# Altium schematic sheet DAC.SchDoc
size 431 x 279 mm; PartNumber: PNXXXXXXX; Organization: ORGANIZATION; Address1: 207; Address2: 13399 104 Ave; Address3: Surrey BC, V3T 0C9; Address4: Canada; Revision: V0.0.0; SheetNumber: 2; SheetTotal: 4; ENG_APP_DATE: --/--/--; DSN_APP_DATE: --/--/--; CHK_APP_DATE: --/--/--
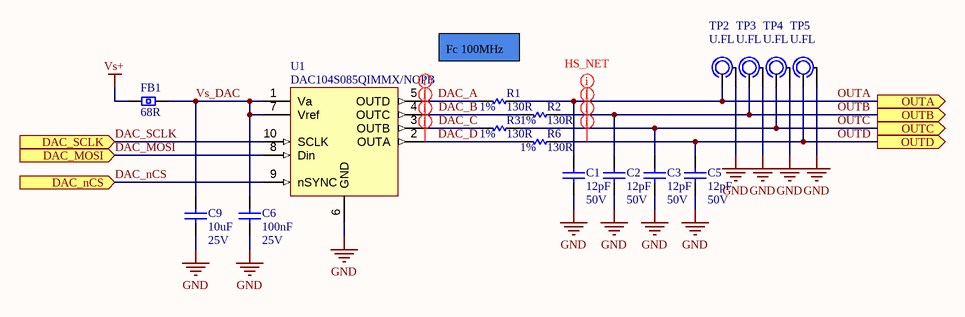
[diagram p0: DAC.SchDoc]

## Parts
C1  12pF  Voltage: 50V  [C0402]
C2  12pF  Voltage: 50V  [C0402]
C3  12pF  Voltage: 50V  [C0402]
C5  12pF  Voltage: 50V  [C0402]
C6  100nF  Voltage Rating: 25V  [C0402]
C9  10uF  Voltage Rating: 25V  [c0805]
FB1  68R  [FB0402]
R1  130R  Tolerance: 1%  [R0402]
R2  130R  Tolerance: 1%  [R0402]
R3  130R  Tolerance: 1%  [R0402]
R6  130R  Tolerance: 1%  [R0402]
TP2  U.FL  [U.FL]
TP3  U.FL  [U.FL]
TP4  U.FL  [U.FL]
TP5  U.FL  [U.FL]
U1  DAC104S085QIMMX/NOPB  [TSSOP50P490X110-10N]

## Ports
DAC_MOSI (in), DAC_nCS (in), DAC_SCLK (in), OUTA (out), OUTB (out), OUTC (out), OUTD (out)

## Nets
GND: C1.1 C2.1 C3.1 C5.1 C6.2 C9.1 TP2.0 TP3.0 TP4.0 TP5.0 U1.6(GND)
Vs+: FB1.2
DAC_A: R1.2 U1.5(OUTD)
DAC_B: R2.2 U1.4(OUTC)
DAC_C: R3.2 U1.3(OUTB)
DAC_D: R6.2 U1.2(OUTA)
DAC_MOSI: U1.8(Din) ; port DAC_MOSI
DAC_nCS: U1.9(nSYNC) ; port DAC_nCS
DAC_SCLK: U1.10(SCLK) ; port DAC_SCLK
OUTA: C1.2 R1.1 TP2.1 ; port OUTA
OUTB: C2.2 R2.1 TP3.1 ; port OUTB
OUTC: C3.2 R3.1 TP4.1 ; port OUTC
OUTD: C5.2 R6.1 TP5.1 ; port OUTD
Vs_DAC: C6.1 C9.2 FB1.1 U1.1(Va) U1.7(Vref)

## Layout directives
net class HS_NET; rule Clearance Constraint [Generic clearance = 10mil, and 30 value(s) for objects]; rule Impedance Constraint [Min = 42.50    Max = 57.50    ]: DAC_A, DAC_B, DAC_C, DAC_D, OUTA, OUTB, OUTC, OUTD

## Notes on the sheet
- Fc 100MHz
- REV:
- PROJECT:
- DATE:
- TITLE
- SHEET
- OF
- DESIGNED:
- REVIEWED:

## Library data of the parts
C1-C3 C5 = CAP CER 12pF 50V C0G 0402: Ceramic capacitor SMD-0402 12pF /50V C0G# J +-5%, Samsung, RoHS; Manufacturer Part Number: CL05C120JB5NNNC; Tolerance: 5%; Dielectric: C0G; Temperature Coefficient: 300ppm/°C; Supplier 1: Digi-Key; Manufacturer: Samsung; RoHS: Yes; Category: Ceramic Capacitors; Stock 1: 41998; Pricing 1: 10000=0.00386, 20000=0.00367 (USD); Mount: Surface Mount; Case/Package: 0402; Case Code (Metric): 1005; Case Code (Imperial): 0402; Material: Ceramic; Contact Plating: Tin; Min Operating Temperature: -55°C; Max Operating Temperature: 125°C; Capacitance: 12pF; Package Quantity: 1; Packaging: Tape and Reel; Voltage Rating: 50V; Series: CL; Construction: Flat; Voltage Rating (DC): 50V; Length: 1mm; Width: 0.02inch; Height: 0.5mm; Thickness: 0.022inch; Depth: 0.5mm; Radiation Hardening: No; RoHS Compliant: Yes; Lead Free: Lead Free; ComponentLink1URL: https://datasheet.ciiva.com/25806/cl05c120jb5nnnc-25806484.pdf?src-supplier=Digi-Key; ComponentLink1Description: https://datasheet.ciiva.com/25806/cl05c120jb5nnnc-25806484.pdf?src-supplier=Digi-Key; ComponentLink2URL: https://datasheet.ciiva.com/26838/getdatasheetpartid-658047-26838280.pdf?src-supplier=Verical; ComponentLink2Description: https://datasheet.ciiva.com/26838/getdatasheetpartid-658047-26838280.pdf?src-supplier=Verical; ComponentLink3URL: https://datasheet.ciiva.com/29198/458703-da-01-en-vs-kondensator-0402-29198421.pdf?src-supplier=Conrad; ComponentLink3Description: https://datasheet.ciiva.com/29198/458703-da-01-en-vs-kondensator-0402-29198421.pdf?src-supplier=Conrad; ComponentLink4URL: https://datasheet.ciiva.com/16449/cl05b104kq5nnnc-16449055.pdf?src-supplier=Future+Electronics; ComponentLink4Description: https://datasheet.ciiva.com/16449/cl05b104kq5nnnc-16449055.pdf?src-supplier=Future+Electronics; Supplier Part Number 1: 1276-1178-2-ND
C6 = CAP CER 100nF 25V X5R 0402: Cap Ceramic 0.1uF 25V X5R 10% Pad SMD 0402 85¡ãC T/R / Multi Layer Ceramic Capacitor (MLCC); Manufacturer: Samsung; Manufacturer Part Number: CL05A104KA5NNNC; Supplier 1: Digi-Key; RoHS: Yes; Category: Ceramic Capacitors; Stock 1: 8053194; Pricing 1: 1=0.10000, 10=0.01100, 50=0.00600, 100=0.00490, 500=0.00346, 1000=0.00272, 2500=0.00248, 5000=0.00228 (USD); Mount: Surface Mount; Case/Package: 0402; Case Code (Metric): 1005; Case Code (Imperial): 0402; Min Operating Temperature: -55°C; Max Operating Temperature: 85°C; Capacitance: 100nF; Tolerance: 10%; Dielectric: X5R; Packaging: Tape and Reel; Package Quantity: 1; Voltage: 25V; Series: CL; Construction: Flat; Voltage Rating (DC): 25V; Length: 1mm; Width: 0.02inch; Height: 0.5mm; Thickness: 0.022inch; Depth: 0.5mm; Radiation Hardening: No; Lead Free: Lead Free; ComponentLink1URL: https://datasheet.ciiva.com/25802/cl05a104ka5nnnc-25802704.pdf?src-supplier=Digi-Key; ComponentLink1Description: https://datasheet.ciiva.com/25802/cl05a104ka5nnnc-25802704.pdf?src-supplier=Digi-Key; ComponentLink2URL: https://datasheet.ciiva.com/26838/getdatasheetpartid-357412-26838142.pdf?src-supplier=Verical; ComponentLink2Description: https://datasheet.ciiva.com/26838/getdatasheetpartid-357412-26838142.pdf?src-supplier=Verical; ComponentLink3URL: https://datasheet.ciiva.com/16437/cl05a104ka5nnnc-16437369.pdf?src-supplier=Future+Electronics; ComponentLink3Description: https://datasheet.ciiva.com/16437/cl05a104ka5nnnc-16437369.pdf?src-supplier=Future+Electronics; ComponentLink4URL: https://datasheet.ciiva.com/26309/mlcc-catalogdownload2013-eng-26309014.pdf?src-supplier=Distrelec; ComponentLink4Description: https://datasheet.ciiva.com/26309/mlcc-catalogdownload2013-eng-26309014.pdf?src-supplier=Distrelec; Supplier Part Number 1: 1276-1043-1-ND
C9 = CAP CER 10uF 25V X5R 0805: Cap Ceramic 10uF 25V X5R 10% SMD 0805 85°C Embossed T/R; Manufacturer: Samsung; Manufacturer Part Number: CL21A106KAYNNNE; Supplier 1: Digi-Key; RoHS: Yes; Category: Ceramic Capacitors; Stock 1: 2266338; Pricing 1: 2000=0.03549, 4000=0.03247 (USD); Mount: Surface Mount; Case/Package: 0805; Case Code (Metric): 2012; Case Code (Imperial): 0805; Min Operating Temperature: -55°C; Max Operating Temperature: 85°C; Package Quantity: 1; Packaging: Tape and Reel; Capacitance: 10uF; Tolerance: 10%; Dielectric: X5R; Series: CL; Construction: Flat; Length: 2mm; Width: 0.049inch; Height: 1.25mm; Depth: 1.25mm; Thickness: 0.057inch; Radiation Hardening: No; RoHS Compliant: Yes; ComponentLink1URL: https://datasheet.ciiva.com/25796/cl21a106kaynnne-25796720.pdf?src-supplier=Digi-Key; ComponentLink1Description: https://datasheet.ciiva.com/25796/cl21a106kaynnne-25796720.pdf?src-supplier=Digi-Key; ComponentLink2URL: https://datasheet.ciiva.com/26838/getdatasheetpartid-357558-26838583.pdf?src-supplier=Verical; ComponentLink2Description: https://datasheet.ciiva.com/26838/getdatasheetpartid-357558-26838583.pdf?src-supplier=Verical; Supplier Part Number 1: 1276-2891-2-ND
FB1 = FB 68R 400mA 310mR 0402: Ferrite Beads Multi-Layer 68Ohm 25% 100MHz 400mA 310mOhm DCR 0402 T/R; Manufacturer: Taiyo Yuden; Manufacturer Part Number: BK1005LL680-T; DC Resistance (DCR): 310mR; Number of Lines: 1; Shielding: Unshielded; Supplier 1: Digi-Key; RoHS: Yes; Category: Ferrite Beads and Chips; Stock 1: 9707; Pricing 1: 1=0.10000, 10=0.04100, 25=0.03640, 50=0.03300, 100=0.02970, 250=0.02176, 500=0.01584, 1000=0.01551, 5000=0.01056 (USD); Mount: Surface Mount; Case/Package: 0402; Number of Pins: 2; Case Code (Metric): 1005; Case Code (Imperial): 0402; Core Material: Ferrite; Min Operating Temperature: -55°C; Max Operating Temperature: 125°C; Packaging: Tape and Reel; Package Quantity: 1; Impedance: 68R; Tolerance: 25%; Max DC Current: 400mA; Termination: SMD/SMT; Test Frequency: 100MHz; Max Current Rating: 400mA; Series: BK; Frequency: 100MHz; Length: 0.039inch; Width: 0.02inch; Height: 0.022inch; Depth: 0.55mm; Halogen Free: Halogen Free; Lead Free: Lead Free; REACH SVHC: Unknown; ComponentLink1URL: https://datasheet.ciiva.com/1013/bk1005ll680-t-ss-1013936.pdf?src-supplier=Digi-Key; ComponentLink1Description: https://datasheet.ciiva.com/1013/bk1005ll680-t-ss-1013936.pdf?src-supplier=Digi-Key; ComponentLink2URL: https://datasheet.ciiva.com/1013/mlci07-e-1013935.pdf?src-supplier=Digi-Key; ComponentLink2Description: https://datasheet.ciiva.com/1013/mlci07-e-1013935.pdf?src-supplier=Digi-Key; ComponentLink3URL: https://datasheet.ciiva.com/1013/mlci07-e-1013937.pdf?src-supplier=Digi-Key; ComponentLink3Description: https://datasheet.ciiva.com/1013/mlci07-e-1013937.pdf?src-supplier=Digi-Key; Supplier Part Number 1: 587-1860-1-ND
R1-R3 R6 = RES 130R 1% 63mW 0402: Res General Purpose Thick Film 0402 130 Ohm 1% 1/16W ±100ppm/°C Molded SMD Paper T/R; Manufacturer 1: Yageo; Manufacturer Part Number 1: RC0402FR-07130RL; Category 1: Chip SMD Resistors; Power Rating: 62.5mW; Voltage Rating: 50V; Max Power Dissipation: 63mW; Supplier 1: Future Electronics; Supplier Part Number 1: 7796683; RoHS 1: Yes; Description 1: Res General Purpose Thick Film 0402 130 Ohm 1% 1/16W ±100ppm/°C Molded SMD Paper T/R; Stock 1: 330000; Pricing 1: 10000=0.00100, 50000=0.00090, 100000=0.00090, 300000=0.00080, 1000000=0.00080, 1250000=0.00080, 3000000=0.00070 (USD); Case/Package: 0402; Case Code (Metric): 1005; Case Code (Imperial): 0402; Min Operating Temperature: -55°C; Max Operating Temperature: 155°C; Value: 130R; Packaging: Tape and Reel; Package Quantity: 1; Resistor Type: Thick Film; Number of Terminations: 2; Termination: SMD/SMT; Temperature Coefficient: 100ppm/°C; Features: Moisture Resistant; Series: RC; Construction: Rectangular; Length: 1mm; Width: 0.02inch; Height: 0.016inch; Depth: 0.5mm; Military Standard: Not; Lead Free: Lead Free; RoHS Compliant: Yes; ComponentLink1URL: https://datasheet.ciiva.com/2519/pyu-r-int-thick-7-2519049.pdf?src-supplier=Digi-Key; ComponentLink1Description: https://datasheet.ciiva.com/2519/pyu-r-int-thick-7-2519049.pdf?src-supplier=Digi-Key; ComponentLink2URL: https://datasheet.ciiva.com/16744/pyu-rc0402-51-rohs-l-6-r-16744959.pdf?src-supplier=Future+Electronics; ComponentLink2Description: https://datasheet.ciiva.com/16744/pyu-rc0402-51-rohs-l-6-r-16744959.pdf?src-supplier=Future+Electronics; ComponentLink3URL: https://datasheet.ciiva.com/15189/getdatasheetpartid-327831-15189351.pdf?src-supplier=Verical; ComponentLink3Description: https://datasheet.ciiva.com/15189/getdatasheetpartid-327831-15189351.pdf?src-supplier=Verical; ComponentLink4URL: https://datasheet.ciiva.com/2519/pyu-r-int-thick-7-2519050.pdf?src-supplier=Digi-Key; ComponentLink4Description: https://datasheet.ciiva.com/2519/pyu-r-int-thick-7-2519050.pdf?src-supplier=Digi-Key; ComponentLink5URL: https://datasheet.ciiva.com/2519/pyu-r-int-thick-7-2519048.pdf?src-supplier=Digi-Key; ComponentLink5Description: https://datasheet.ciiva.com/2519/pyu-r-int-thick-7-2519048.pdf?src-supplier=Digi-Key; ComponentLink6URL: https://datasheet.ciiva.com/12666/pyu-rc0402-51-rohs-l-6-r-12666955.pdf?src-supplier=Mouser; ComponentLink6Description: https://datasheet.ciiva.com/12666/pyu-rc0402-51-rohs-l-6-r-12666955.pdf?src-supplier=Mouser
TP2-TP5 = TP U.FL: CONN U.FL RCPT STR 50 OHM SMD; Manufacturer: Hirose; Manufacturer Part Number: U.FL-R-SMT-1(80); Body Material: Bronze; Body Plating: Silver; Center Contact Plating: Gold; Dielectric Material: Polymer; Connector Type: Receptacle,Male Pin; Impedance: 50R; Max Frequency: 6GHz; Number of Ports: 1; Mating Cycles: 30; Supplier 1: Future Electronics; RoHS: Yes; Category: RF / Coaxial Connectors; Stock 1: 40000; Pricing 1: 10000=0.81500, 20000=0.80000, 30000=0.78500 (USD); Mount: Surface Mount; Case/Package: SMD/SMT; Contact Material: Brass; Housing Color: Beige; Min Operating Temperature: -40°C; Max Operating Temperature: 90°C; Package Quantity: 10000; Packaging: Tape and Reel; Fastening Type: SNAP-ON; Series: U.FL; Termination: Solder; Lead Free: Lead Free; RoHS Compliant: Yes; ComponentLink1URL: http://www.mouser.com/ds/2/185/U.FL_catalog-939761.pdf?src-supplier=Mouser; ComponentLink1Description: http://www.mouser.com/ds/2/185/U.FL_catalog-939761.pdf?src-supplier=Mouser; ComponentLink2URL: https://www.hirose.com/product/en/download_file/key_name/U.FL-R-SMT-1%2880%29/category/Specification%20Sheet/doc_file_id/37638/?file_category_id=9&item_id=03310472280&is_series=&src-supplier=Digi-Key; ComponentLink2Description: https://www.hirose.com/product/en/download_file/key_name/U.FL-R-SMT-1%2880%29/category/Specification%20Sheet/doc_file_id/37638/?file_category_id=9&item_id=03310472280&is_series=&src-supplier=Digi-Key
U1 = IC DAC 10b 4chan DAC104S085QIMMX/NOPB: DAC 4-CH Resistor-String 10-bit Automotive 10-Pin VSSOP T/R; Manufacturer 1: Texas Instruments; Category 1: Digital to Analog Converters (DACs); Nominal Supply Current: 650uA; Interface: SPI; Max Supply Voltage: 3.6V; Min Supply Voltage: 2.7V; Number of DAC Channels: 4; Resolution: 10b; Settling Time: 6us; Number of Bits: 10; Integral Nonlinearity (INL): 2LSB; Differential Nonlinearity: 0.35LSB; Power Consumption: 1.1mW; Polarity: Unipolar; Output Type: Voltage; Supplier 1: Mouser; Supplier Part Number 1: 595-C104S085QIMMXNPB; Manufacturer Part Number 1: DAC104S085QIMMX/NOPB; RoHS 1: Yes; Description 1: DAC 4-CH Resistor-String 10-bit Automotive 10-Pin VSSOP T/R; Stock 1: 1920; Pricing 1: 1=6.10000, 10=5.48000, 50=5.18000, 100=4.49000, 1000=3.34000, 10000=3.34000 (USD); Case/Package: VSSOP; Pins: 10; Min Operating Temperature: -40°C; Max Operating Temperature: 125°C; Package Quantity: 3500; Number of Converters: 4; Packaging: Tape and Reel; Output Polarity: Unipolar; Supply Current: 650uA; Series: DAC104S085-Q1; Lead Free: Lead Free; RoHS Compliant: Yes; ComponentLink1URL: http://components.arrow.com/part/dataview/57166829S421825N1317?src-supplier=Arrow+Electronics; ComponentLink1Description: http://components.arrow.com/part/dataview/57166829S421825N1317?src-supplier=Arrow+Electronics; ComponentLink2URL: http://www.ti.com/general/docs/suppproductinfo.tsp?distId=10&amp;gotoUrl=http%3A%2F%2Fwww.ti.com%2Flit%2Fgpn%2Fdac104s085-q1&src-supplier=Digi-Key; ComponentLink2Description: http://www.ti.com/general/docs/suppproductinfo.tsp?distId=10&amp;gotoUrl=http%3A%2F%2Fwww.ti.com%2Flit%2Fgpn%2Fdac104s085-q1&src-supplier=Digi-Key; ComponentLink3URL: http://www.ti.com/lit/gpn/dac104s085-q1?src-supplier=Mouser; ComponentLink3Description: http://www.ti.com/lit/gpn/dac104s085-q1?src-supplier=Mouser; ComponentLink4URL: http://www.ti.com/general/docs/lit/getliterature.tsp?genericPartNumber=DAC104S085-Q1&&fileType=pdf&src-supplier=Avnet; ComponentLink4Description: http://www.ti.com/general/docs/lit/getliterature.tsp?genericPartNumber=DAC104S085-Q1&&fileType=pdf&src-supplier=Avnet; ComponentLink5URL: http://www.ti.com/lit/ds/symlink/dac104s085-q1.pdf?src-supplier=Digi-Key; ComponentLink5Description: http://www.ti.com/lit/ds/symlink/dac104s085-q1.pdf?src-supplier=Digi-Key